# EAGLE schematic potencia (EAGLE 6.1)

## Sheet 1 of 3: Monitor Bateria
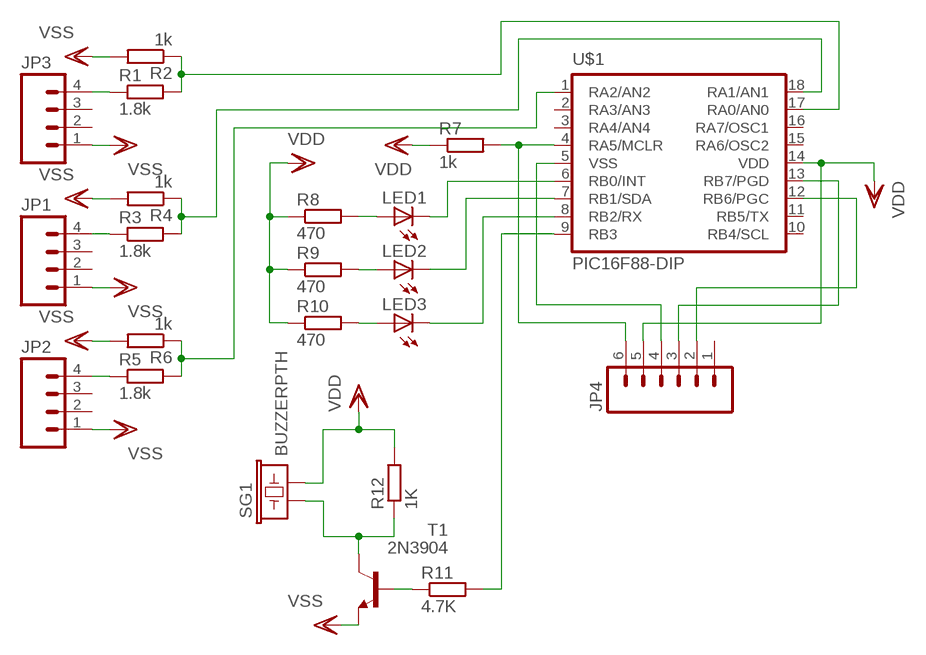
[diagram p0: schematic, sheet 1]

### Parts
JP1  M04LONGPADS  [1X04_LONGPADS]
JP2  M04LONGPADS  [1X04_LONGPADS]
JP3  M04LONGPADS  [1X04_LONGPADS]
JP4  M06LONGPADS  [1X06_LONGPADS]
LED1  LED3MM  [LED3MM]
LED2  LED3MM  [LED3MM]
LED3  LED3MM  [LED3MM]
R1  1.8k  R-EU_0204/5  [0204/5]
R2  1k  R-EU_0204/5  [0204/5]
R3  1.8k  R-EU_0204/5  [0204/5]
R4  1k  R-EU_0204/5  [0204/5]
R5  1.8k  R-EU_0204/5  [0204/5]
R6  1k  R-EU_0204/5  [0204/5]
R7  1k  R-EU_0204/5  [0204/5]
R8  470  R-EU_0204/5  [0204/5]
R9  470  R-EU_0204/5  [0204/5]
R10  470  R-EU_0204/5  [0204/5]
R11  4.7K  R-EU_0204/5  [0204/5]
R12  1K  R-EU_0204/5  [0204/5]
SG1  BUZZERPTH  [BUZZER-12MM]
T1  2N3904  [TO92]
U$1  PIC16F88-DIP  [DIL18]

### Nets
N$1: JP3.4 R1.1
N$2: R1.2 R2.1 U$1.17(RA0/AN0)
N$3: JP1.4 R3.1
N$4: R3.2 R4.1 U$1.18(RA1/AN1)
N$5: JP2.4 R5.1
N$6: R5.2 R6.1 U$1.1(RA2/AN2)
N$7: JP4.4 U$1.5(VSS)
N$8: LED1.K(C) U$1.6(RB0/INT)
N$9: LED2.K(C) U$1.7(RB1/SDA)
N$10: LED3.K(C) U$1.8(RB2/RX)
N$11: LED1.A R8.2
N$12: JP4.3 U$1.13(RB7/PGD)
N$13: LED2.A R9.2
N$14: LED3.A R10.2
N$15: JP4.2 U$1.12(RB6/PGC)
N$16: JP4.6 R7.2 U$1.4(RA5/MCLR)
N$17: R11.2 U$1.9(RB3)
N$19: R11.1 T1.2(B)
N$20: R12.1 SG1.+ T1.1(C)
VDD: JP4.5 R7.1 R8.1 R9.1 R10.1 R12.2 SG1.- U$1.14(VDD)
VSS: JP1.1 JP2.1 JP3.1 R2.2 R4.2 R6.2 T1.3(E) ; also sheet 2
Unconnected: JP1.2 JP1.3 JP2.2 JP2.3 JP3.2 JP3.3 JP4.1 U$1.2(RA3/AN3) U$1.3(RA4/AN4) U$1.10(RB4/SCL) U$1.11(RB5/TX) U$1.15(RA6/OSC2) U$1.16(RA7/OSC1)

## Sheet 2 of 3: Regulación de Voltaje
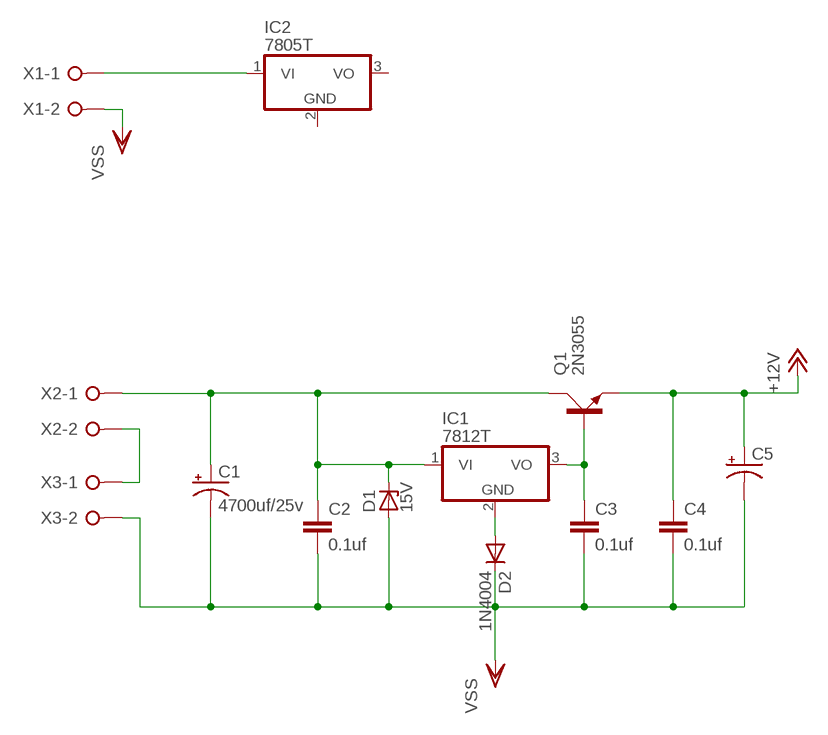
[diagram p1: schematic, sheet 2]

### Parts
C1  4700uf/25v  CPOL-USE10-30  [EB30D]
C2  0.1uf  C-EU050-024X044  [C050-024X044]
C3  0.1uf  C-EU050-024X044  [C050-024X044]
C4  0.1uf  C-EU050-024X044  [C050-024X044]
C5  CPOL-USE2.5-6  [E2,5-6]
D1  15V  ZENER-DIODEF126-10  [F126Z10]
D2  1N4004  [DO41-10]
IC1  7812T  [TO220H]
IC2  7805T  [TO220H]
Q1  2N3055  [TO3A]
X1  W237-2N  [W237-2N]
X2  W237-2N  [W237-2N]
X3  W237-2N  [W237-2N]

### Nets
+12V: C4.1 C5.+ Q1.E
N$18: X2.2 X3.1
N$21: C1.+ C2.1 D1.C IC1.1(VI) Q1.C Q1.C1(C) X2.1
N$22: C3.1 IC1.3(VO) Q1.B
N$23: IC2.1(VI) X1.1
N$24: D2.A IC1.2(GND)
VSS: C1.- C2.2 C3.2 C4.2 C5.- D1.A D2.C X1.2 X3.2 ; also sheet 1
Unconnected: IC2.2(GND) IC2.3(VO)

## Sheet 3 of 3: wired

## Library data of the parts
C1 C5 = rcl:CPOL-US: POLARIZED CAPACITOR, American symbol
C2-C4 = rcl:C-EU: CAPACITOR, European symbol
D1 = diode:ZENER-DIODE: Z-Diode
D2 = adafruit:1N4004: DIODE General purpose 1N400x type rectifier (With bigger pads) http://www.ladyada.net/library/pcb/eaglelibrary.html
IC1 IC2 = adafruit:78*: Positive VOLTAGE REGULATOR Added bigger pads to the TO-92 package
JP1-JP3 = SparkFun:M04: Header 4 Standard 4-pin 0.1" header. Use with straight break away headers (SKU : PRT-00116), right angle break away headers (PRT-00553), swiss pins (PRT-00743), machine pins (PRT-00117), and female headers (PRT-00115). Molex polarized connector foot print use with SKU : PRT-08231 with associated crimp pins and housings. 1MM SMD Version SKU: PRT-10208
JP4 = SparkFun:M06: Header 6 Standard 6-pin 0.1" header. Use with straight break away headers (SKU : PRT-00116), right angle break away headers (PRT-00553), swiss pins (PRT-00743), machine pins (PRT-00117), and female headers (PRT-00115). Molex polarized connector foot print use with SKU : PRT-08094 with associated crimp pins and housings. NOTES ON THE VARIANTS LOCK and LOCK_LONGPADS... This footprint was designed to help hold the alignment of a through-hole component (i.e. 6-pin header) while soldering it into place. You may notice that each hole has been shifted either up or down by 0.005 of an inch from it's more standard position (which is a perfectly straight line). This slight alteration caused the pins (the squares in the middle) to touch the edges of the holes. Because they are alternating, it causes a "brace" to hold the component in place. 0.005 has proven to be the perfect amount of "off-center" position when using our standard breakaway headers. Although looks a little odd when you look at the bare footprint, once you have a header in there, the alteration is very hard to notice. Also, if you push a header all the way into place, it is covered up entirely on the bottom side. This idea of altering the position of holes to aid alignment will be further integrated into the Sparkfun Library for other footprints. It can help hold any component with 3 or more connection pins.
LED1-LED3 = adafruit:LED: LED OSRAM: - CHIPLED LG R971, LG N971, LY N971, LG Q971, LY Q971, LO R971, LY R971 LH N974, LH R974 LS Q976, LO Q976, LY Q976 LO Q996 - Hyper CHIPLED LW Q18S LB Q993, LB Q99A, LB R99A - SideLED LS A670, LO A670, LY A670, LG A670, LP A670 LB A673, LV A673, LT A673, LW A673 LH A674 LY A675 LS A676, LA A676, LO A676, LY A676, LW A676 LS A679, LY A679, LG A679 - Hyper Micro SIDELED® LS Y876, LA Y876, LO Y876, LY Y876 LT Y87S - SmartLED LW L88C, LW L88S LB L89C, LB L89S, LG L890 LS L89K, LO L89K, LY L89K LS L896, LA L896, LO L896, LY L896 - TOPLED LS T670, LO T670, LY T670, LG T670, LP T670 LSG T670, LSP T670, LSY T670, LOP T670, LYG T670 LG T671, LOG T671, LSG T671 LB T673, LV T673, LT T673, LW T673 LH T674 LS T676, LA T676, LO T676, LY T676, LB T676, LH T676, LSB T676, LW T676 LB T67C, LV T67C, LT T67C, LS T67K, LO T67K, LY T67K, LW E67C LS E67B, LA E67B, LO E67B, LY E67B, LB E67C, LV E67C, LT E67C LW T67C LS T679, LY T679, LG T679 LS T770, LO T770, LY T770, LG T770, LP T770 LB T773, LV T773, LT T773, LW T773 LH T774 LS E675, LA E675, LY E675, LS T675 LS T776, LA T776, LO T776, LY T776, LB T776 LHGB T686 LT T68C, LB T68C - Hyper Mini TOPLED® LB M676 - Mini TOPLED Santana® LG M470 LS M47K, LO M47K, LY M47K Source: http://www.osram.convergy.de/
Q1 = transistor-power:2N3055: NPN TRANSISTOR
R1-R12 = rcl:R-EU_: RESISTOR, European symbol
SG1 = SparkFun:BUZZER: Buzzer 12mm Spark Fun Electronics SKU : Comp-Buzzer
T1 = transistor:2N3904: NPN TRANSISTOR
U$1 = SparkFun:PIC16F88-DIP
X1-X3 = con-wago-508:W237-2N: WAGO SREW CLAMP; OC_FARNELL: unknown; OC_NEWARK: unknown